# Altium schematic sheet AnalogInterface2.SchDoc: Analog Interface
size A4; DrawnBy: Zheng; DocumentNumber: 2; Revision: 3; SheetNumber: 2; SheetTotal: 4
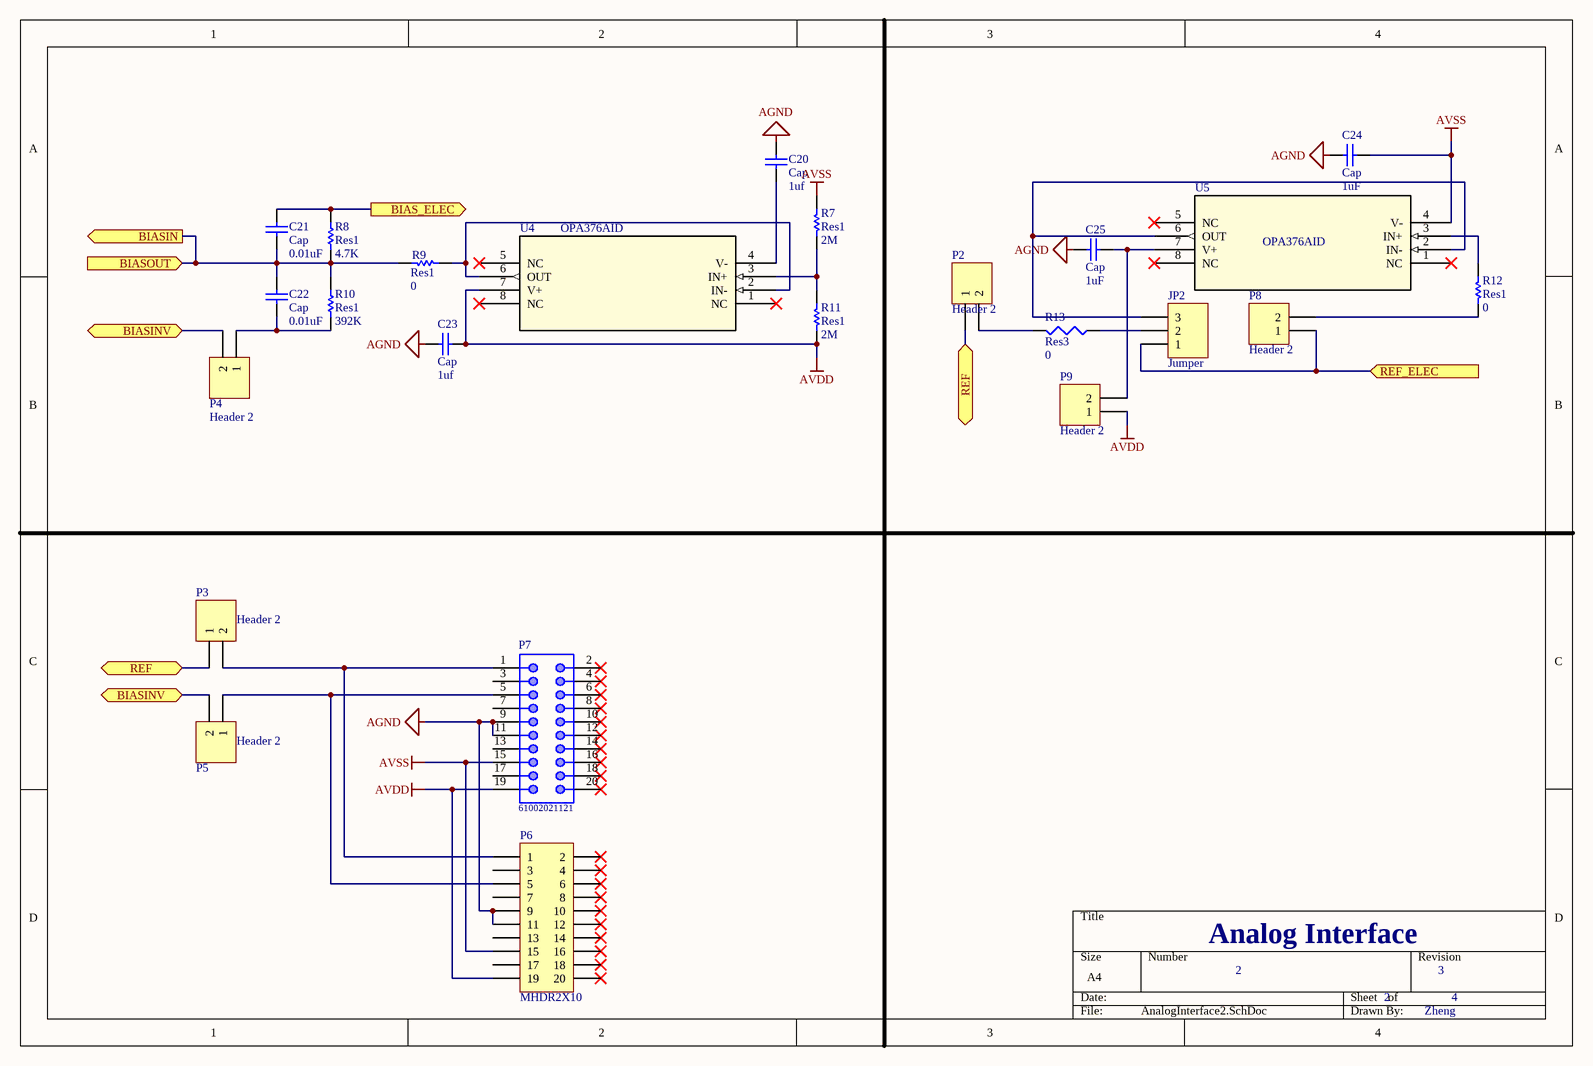
[diagram p0: AnalogInterface2.SchDoc]

## Parts
C20  Cap  value 1uf  [0402C]
C21  Cap  value 0.01uF  [0402C]
C22  Cap  value 0.01uF  [0402C]
C23  Cap  value 1uf  [0402C]
C24  Cap  value 1uF  [0402C]
C25  Cap  value 1uF  [0402C]
JP2  Jumper  [HDR1X3]
P2  Header 2  [HDR1X2]
P3  Header 2  [HDR1X2]
P4  Header 2  [HDR1X2]
P5  Header 2  [HDR1X2]
P6  MHDR2X10  [HDR2.54-M-LS-2x10P]
P7  61002021121  [61002021121]
P8  Header 2  [HDR1X2]
P9  Header 2  [HDR1X2]
R7  Res1  value 2M  [0603]
R8  Res1  value 4.7K  [0603]
R9  Res1  value 0  [0603]
R10  Res1  value 392K  [0603]
R11  Res1  value 2M  [0603]
R12  Res1  value 0  [0603]
R13  Res3  value 0  [0603]
U4  OPA376AID  [SOIC8]
U5  OPA376AID  [SOIC8]

## Ports
BIAS_ELEC (out), BIASIN (out), BIASINV (bidir), BIASOUT (in), REF (bidir), REF_ELEC (in)

## Nets
AGND: C20.1 C23.1 C24.2 C25.2 P6.9 P6.11 P7.9 P7.11
AVDD: C23.2 P6.19 P7.19 P9.1 R11.2 U4.7(V+)
AVSS: C24.1 P6.15 P7.15 R7.1 U5.4(V-)
BIAS_ELEC: C21.2 R8.1 ; port BIAS_ELEC
BIASIN: C21.1 C22.2 R8.2 R9.1 R10.1 ; port BIASOUT, port BIASIN
BIASINV: P4.2 P5.2 ; port BIASINV
REF: P2.1 P3.1 ; port REF
REF_ELEC: JP2.1 P8.1 ; port REF_ELEC
NetC20_2: C20.2 U4.4(V-)
NetC22_1: C22.1 P4.1 R10.2
NetC25_1: C25.1 P9.2 U5.7(V+)
NetJP2_2: JP2.2 R13.2
NetJP2_3: JP2.3 U5.2(IN-) U5.6(OUT)
NetP2_2: P2.2 R13.1
NetP3_2: P3.2 P6.1 P7.1
NetP5_1: P5.1 P6.5 P7.5
NetP8_2: P8.2 R12.1
NetR7_2: R7.2 R11.1 U4.3(IN+)
NetR9_2: R9.2 U4.2(IN-) U4.6(OUT)
NetR12_2: R12.2 U5.3(IN+)

Not connected (* = marked no-connect by the designer): P6 2* 3 4* 6* 7 8* 10* 12* 13 14* 16* 17 18* 20*; P7 2* 3 4* 6* 7 8* 10* 12* 13 14* 16* 17 18* 20*; U4 1(NC)* 5(NC)* 8(NC)*; U5 1(NC)* 5(NC)* 8(NC)*

## Notes on the sheet
- Title
- Size:
- Date:
- A4
- Number:
- Time:
- Revision:
- Sheet
- of
- File:

## Library data of the parts
C20-C25 = Cap: Capacitor; Published: 8-Jun-2000; LatestRevisionDate: 17-Jul-2002; LatestRevisionNote: Re-released for DXP Platform.; PackageReference: RAD-0.3; Publisher: Altium Limited; PackageDescription: Radial Cap, Thru-Hole; 2 Leads; 0.3 in Pin Spacing
JP2 = Header 3: Header, 3-Pin; LatestRevisionDate: 17-Jul-2002; LatestRevisionNote: Re-released for DXP Platform.; Publisher: Altium Limited
P2-P5 P8 P9 = Header 2: Header, 2-Pin; LatestRevisionDate: 17-Jul-2002; LatestRevisionNote: Re-released for DXP Platform.; Publisher: Altium Limited
P6 = MHDR2X10: Header, 10-Pin, Dual row; LatestRevisionDate: 17-Jul-2002; LatestRevisionNote: Re-released for DXP Platform.; Publisher: Altium Limited
P7 = 61002021121: SMT Vertical Pin Header WR-PHD, Pitch 2.54 mm, Dual Row, 20 pins; Pin Number: 20; Pitch: 2.54 mm; Gender: Male; Rated Current: 3 A; Working Voltage: 250 VAC; Withstanding Voltage: 500 VAC; Contact Resistance: 20 mOhm; ComponentLink1Description: Manufacturer; ComponentLink1URL: http://www.we-online.de; ComponentLink2Description: Datasheet; ComponentLink2URL: https://katalog.we-online.de/em/datasheet/6100xx21121.pdf; Part Number: 61002021121; Published Date: August 2018; Publisher: Wurth Elektronik; Operating Temperature: -40 to 125 degC; Mounting Technology: SMT; Packaging: Tube; Row Number: Dual; Orientation: Vertical
R7-R12 = Res1: Resistor; Published: 8-Jun-2000; LatestRevisionDate: 17-Jul-2002; LatestRevisionNote: Re-released for DXP Platform.; PackageReference: AXIAL-0.3; Publisher: Altium Limited; PackageDescription: Axial Device, Thru-Hole; 2 Leads; 0.3 in Pin Spacing
R13 = Res3: Resistor; Published: 8-Jun-2000; LatestRevisionDate: 29-May-2009; LatestRevisionNote: IPC-7351 Footprint Added.; PackageReference: J1-0603; Publisher: Altium Limited; PackageDescription: Chip Resistor
U4 U5 = OPA376AID: Precision, Low Noise, Low Iq Operational Amplifier; Manufacturer: Texas Instruments; GENERIC_PART_NUMBER: OPA376; INDUSTRY_STD_PKG_TYPE: SOIC; FAMILY_NAME: LOW OFFSET VOLTAGE; PIN_COUNT: 8; PACKAGE_DESIGNATOR: D; Datasheet_URL: http://www.ti.com/lit/gpn/OPA376; Vendor: Texas Instruments; Manufacturer_Part_Number: OPA376AID; Copyright: Copyright (C) 2018 Accelerated Designs. All rights reserved; RefDes: RefDes; Type: DEV